# EAGLE design soil_sensor (EAGLE 9.6.2)
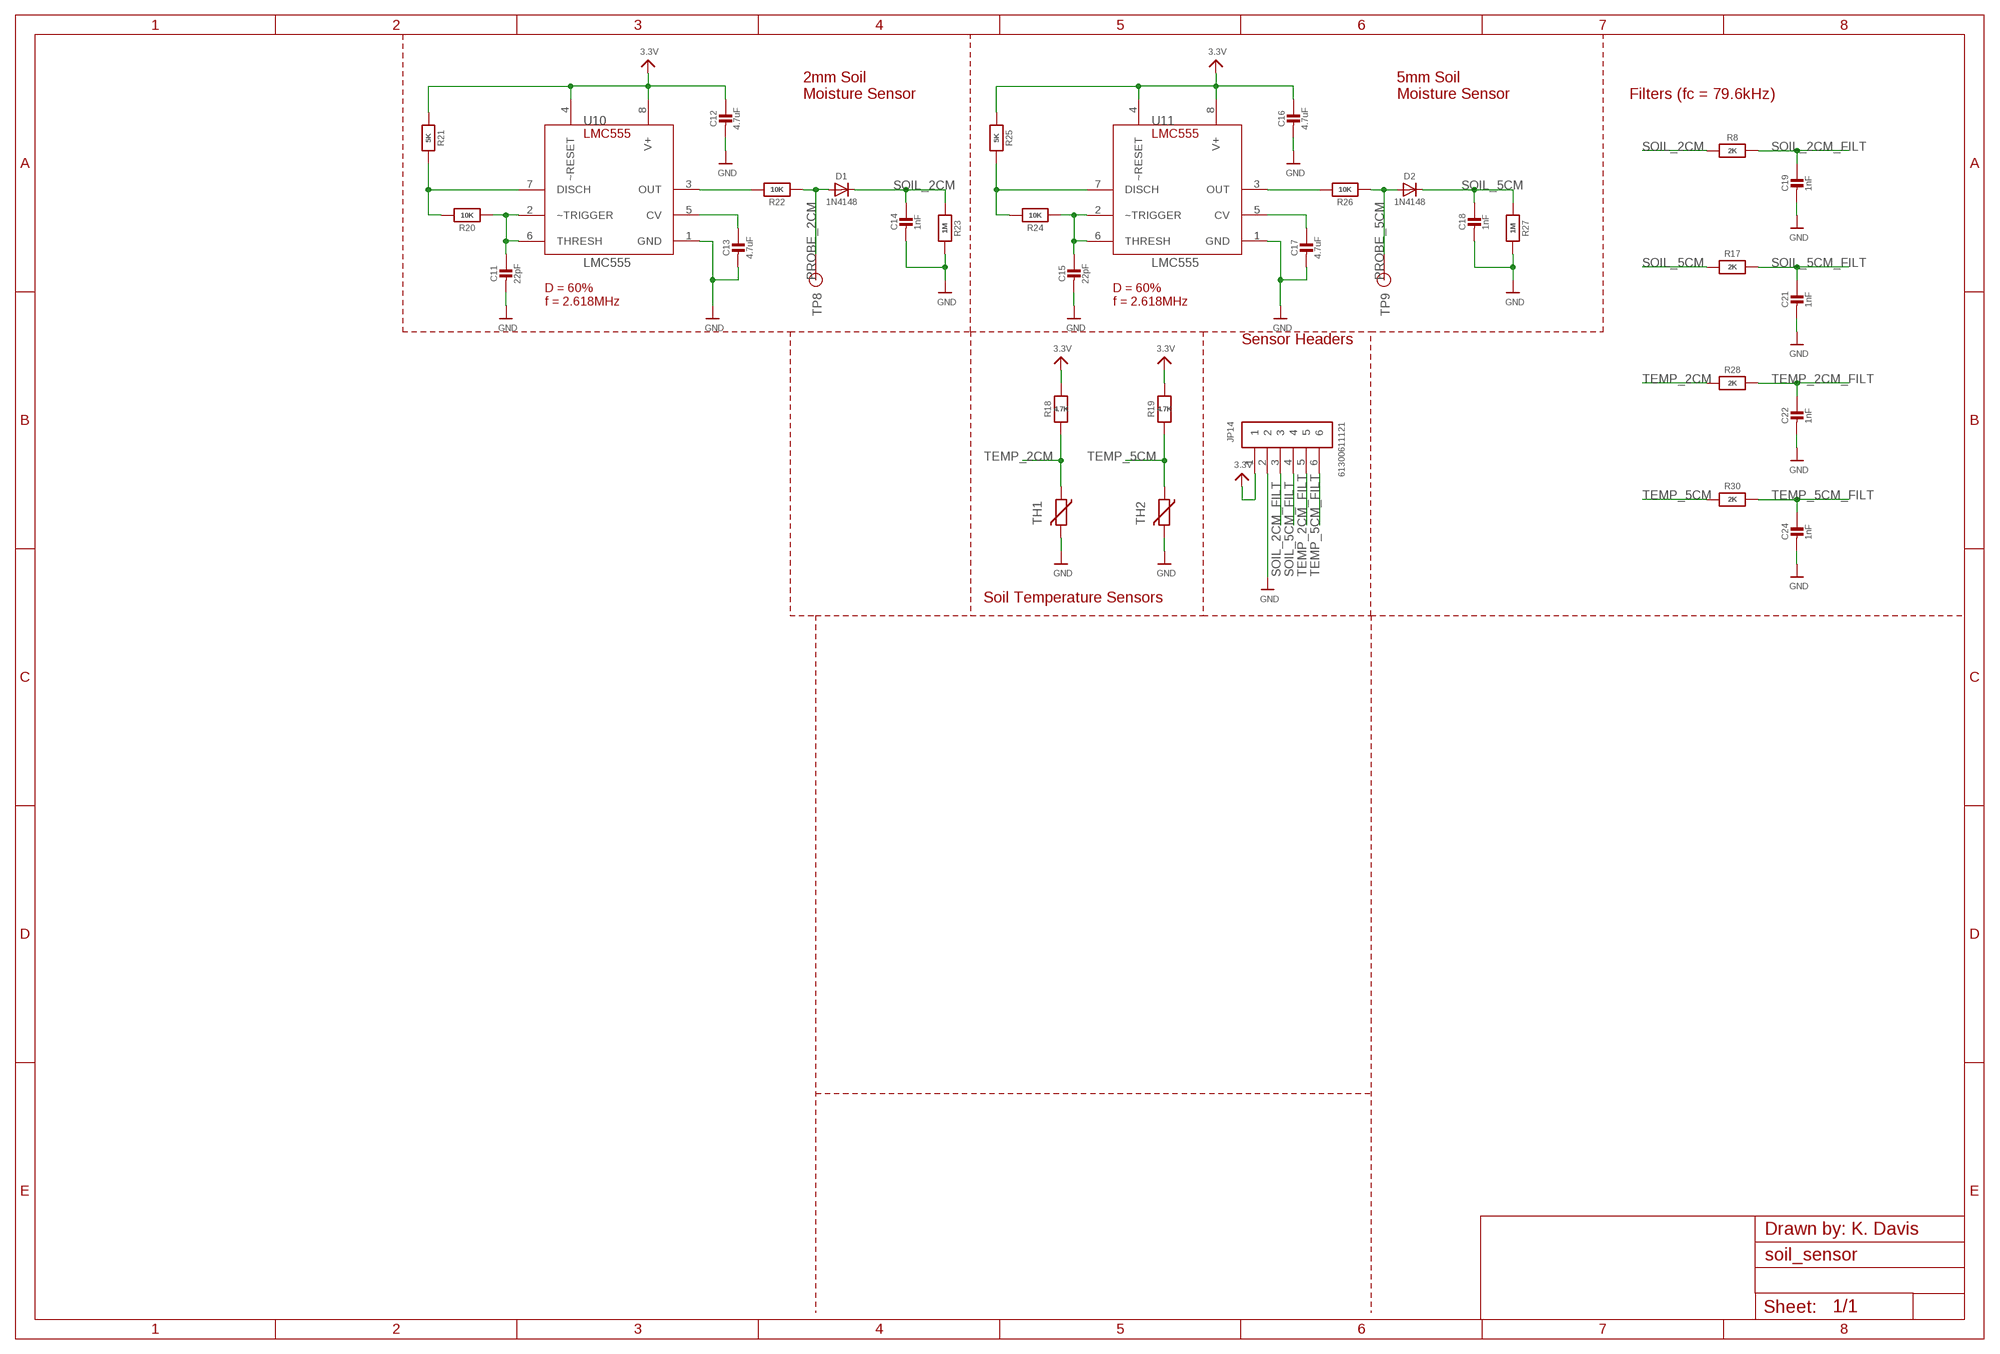
[diagram p0: schematic, sheet 1]

## Parts
C11  22pF  CAP_CERAMIC0805-NOOUTLINE  [0805-NO]
C12  4.7uF  CAP_CERAMIC0805-NOOUTLINE  [0805-NO]
C13  4.7uF  CAP_CERAMIC0805-NOOUTLINE  [0805-NO]
C14  1nF  CAP_CERAMIC0805-NOOUTLINE  [0805-NO]
C15  22pF  CAP_CERAMIC0805-NOOUTLINE  [0805-NO]
C16  4.7uF  CAP_CERAMIC0805-NOOUTLINE  [0805-NO]
C17  4.7uF  CAP_CERAMIC0805-NOOUTLINE  [0805-NO]
C18  1nF  CAP_CERAMIC0805-NOOUTLINE  [0805-NO]
C19  1nF  CAP_CERAMIC0805-NOOUTLINE  [0805-NO]
C21  1nF  CAP_CERAMIC0805-NOOUTLINE  [0805-NO]
C22  1nF  CAP_CERAMIC0805-NOOUTLINE  [0805-NO]
C24  1nF  CAP_CERAMIC0805-NOOUTLINE  [0805-NO]
D1  1N4148  DIODESOD-323  [SOD-323]
D2  1N4148  DIODESOD-323  [SOD-323]
JP14  61300611121  [61300611121]
R8  2K  RESISTOR_0603_NOOUT  [0603-NO]
R17  2K  RESISTOR_0603_NOOUT  [0603-NO]
R18  4.7K  RESISTOR0805_NOOUTLINE  [0805-NO]
R19  4.7K  RESISTOR0805_NOOUTLINE  [0805-NO]
R20  10K  RESISTOR0805_NOOUTLINE  [0805-NO]
R21  5K  RESISTOR0805_NOOUTLINE  [0805-NO]
R22  10K  RESISTOR0805_NOOUTLINE  [0805-NO]
R23  1M  RESISTOR0805_NOOUTLINE  [0805-NO]
R24  10K  RESISTOR0805_NOOUTLINE  [0805-NO]
R25  5K  RESISTOR0805_NOOUTLINE  [0805-NO]
R26  10K  RESISTOR0805_NOOUTLINE  [0805-NO]
R27  1M  RESISTOR0805_NOOUTLINE  [0805-NO]
R28  2K  RESISTOR_0603_NOOUT  [0603-NO]
R30  2K  RESISTOR_0603_NOOUT  [0603-NO]
TH1  VARISTORCN1206  [CT/CN1206]
TH2  VARISTORCN1206  [CT/CN1206]
TP8  TP  [TP_50MIL_CIRC]
TP9  TP  [TP_50MIL_CIRC]
U10  LMC555  [SOIC-8]
U11  LMC555  [SOIC-8]

## Nets
3.3V: C12.1 C16.1 JP14.1 R18.2 R19.2 R21.1 R25.1 U10.4(~RESET) U10.8(V+) U11.4(~RESET) U11.8(V+)
FGD: C11.2 C12.2 C13.2 C14.2 C15.2 C16.2 C17.2 C18.2 C19.2 C21.2 C22.2 C24.2 JP14.2 R23.2 R27.2 TH1.2 TH2.2 U10.1(GND) U11.1(GND) ; supply symbol labelled GND
N$12: C11.1 R20.1 U10.2(~TRIGGER) U10.6(THRESH)
N$14: R20.2 R21.2 U10.7(DISCH)
N$15: C13.1 U10.5(CV)
N$16: C15.1 R24.1 U11.2(~TRIGGER) U11.6(THRESH)
N$19: R24.2 R25.2 U11.7(DISCH)
N$20: R22.2 U10.3(OUT)
N$21: C17.1 U11.5(CV)
N$22: R26.2 U11.3(OUT)
PROBE_2CM: D1.A R22.1 TP8.1(TP)
PROBE_5CM: D2.A R26.1 TP9.1(TP)
SOIL_2CM: C14.1 D1.C R8.1 R23.1
SOIL_2CM_FILT: C19.1 JP14.3 R8.2
SOIL_5CM: C18.1 D2.C R17.1 R27.1
SOIL_5CM_FILT: C21.1 JP14.4 R17.2
TEMP_2CM: R18.1 R28.1 TH1.1
TEMP_2CM_FILT: C22.1 JP14.5 R28.2
TEMP_5CM: R19.1 R30.1 TH2.1
TEMP_5CM_FILT: C24.1 JP14.6 R30.2

## Notes on the sheet
- 2mm Soil
  Moisture Sensor
- 5mm Soil
  Moisture Sensor
- Filters (fc = 79.6kHz)
- D = 60%
  f = 2.618MHz
- D = 60%
  f = 2.618MHz
- Sensor Headers
- Soil Temperature Sensors
- Drawn by: K. Davis

## Library data of the parts
C11-C19 C21 C22 C24 = microbuilder:CAP_CERAMIC: Ceramic Capacitors For new designs, use the packages preceded by an '_' character since they are more reliable: The following footprints should be used on most boards: _0402 - Standard footprint for regular board layouts _0603 - Standard footprint for regular board layouts _0805 - Standard footprint for regular board layouts _1206 - Standard footprint for regular board layouts For extremely tight-pitch boards where space is at a premium, the following 'micro-pitch' footprints can be used (smaller pads, no silkscreen outline, etc.): _0402MP - Micro-pitch footprint for very dense/compact boards _0603MP - Micro-pitch footprint for very dense/compact boards _0805MP - Micro-pitch footprint for very dense/compact boards _1206MP - Micro-pitch footprint for very dense/compact boards
D1 D2 = microbuilder:DIODE: Diode SMA Model Volts Amps Type Vf Ir Digikey # Notes SSA34-E3 40V 3A Schottky 480mV @ 3A 200uA @ 40V SSA34-E3/61TGITR-ND CDBA120-G 20V 1A Schottky 500mV @ 1A 500uA @ 20V 641-1014-6-ND REEL MBRA210 10V 2A Schottky 350mV @ 2A 700uA @ 10V MBRA210LT3 SOD-123 Model Volts Amps Type Vf Ir Order # Notes BAT54T1G 30V 200mA Schottky 800mV @ 200mA 2uA @ 25V BAT54T1GOSTR-ND B0530W 30V 500mA Schottky 430mV @ 500mA 130uA @ 30V B0530W-FDICT-ND REEL MBR120 20V 1A Schottky 340mV @ 1A MBR120VLSFT1GOSCT-ND SOD-323 Model Volts Amps Type Vf Ir Order # Notes PMEG2005EJ 20V 500mA Schottky 355mV @ 500mA 568-4110-1-ND ZLLS410 10V 570mA Schottky 380mV @ 570mA ZLLS410CT-ND 1N4148WS 75V 150mA Silicon/Simple 1V 1N4148WSFSCT-ND REEL SOD-523 Model Volts Amps Type Vf Ir Order # Notes BAT54XV2 30V 200mA Schottky 0.8V @ 100mA BAT54XV2CT-ND TB751S 30V 30mA Schottky RB751S-40TE61CT-ND SOT23-R/W (R = Solder Paste/Reflow Ovens, W = Hand-Soldering) Model Volts Amps Type Vf Ir Order # Notes BAT54FILM 40V 300mA Schottky 497-7162-1-ND POWERDI-5 Model Volts Amps Type Vf Ir Order # Notes PDS560 60V 5A Schottky 670mV @ 5A 150uA @ 60V PDS560DICT-ND
JP14 = EarthPodLib:61300611121: CONN HEADER VERT 5POS 2.54MM Manufacturer's datasheet <https://katalog.we-online.de/em/datasheet/6130xx11121.pdf>; CREATED_BY: PCBLayout.com; DIGI_KEY_PART_NUMBER: 732-5318-ND; MANUFACTURER: Wurth Electronics Inc.; MPN: 61300511121
R8 R17-R28 R30 = microbuilder:RESISTOR: Resistors For new designs, use the packages preceded by an '_' character since they are more reliable: The following footprints should be used on most boards: _0402 - Standard footprint for regular board layouts _0603 - Standard footprint for regular board layouts _0805 - Standard footprint for regular board layouts _1206 - Standard footprint for regular board layouts For extremely tight-pitch boards where space is at a premium, the following 'micro-pitch' footprints can be used (smaller pads, no silkscreen outline, etc.): _0402MP - Micro-pitch footprint for very dense/compact boards _0603MP - Micro-pitch footprint for very dense/compact boards _0805MP - Micro-pitch footprint for very dense/compact boards _1206MP - Micro-pitch footprint for very dense/compact boards
TH1 TH2 = varistor:VARISTOR: VARISTOR
TP8 TP9 = EarthPodLib:TP
U10 U11 = EarthPodLib:LMC555

## Net classes
1 highpower: width 0.305 mm, drill 0.483 mm
2 lowpower: width 0.254 mm, drill 0.483 mm

## Board
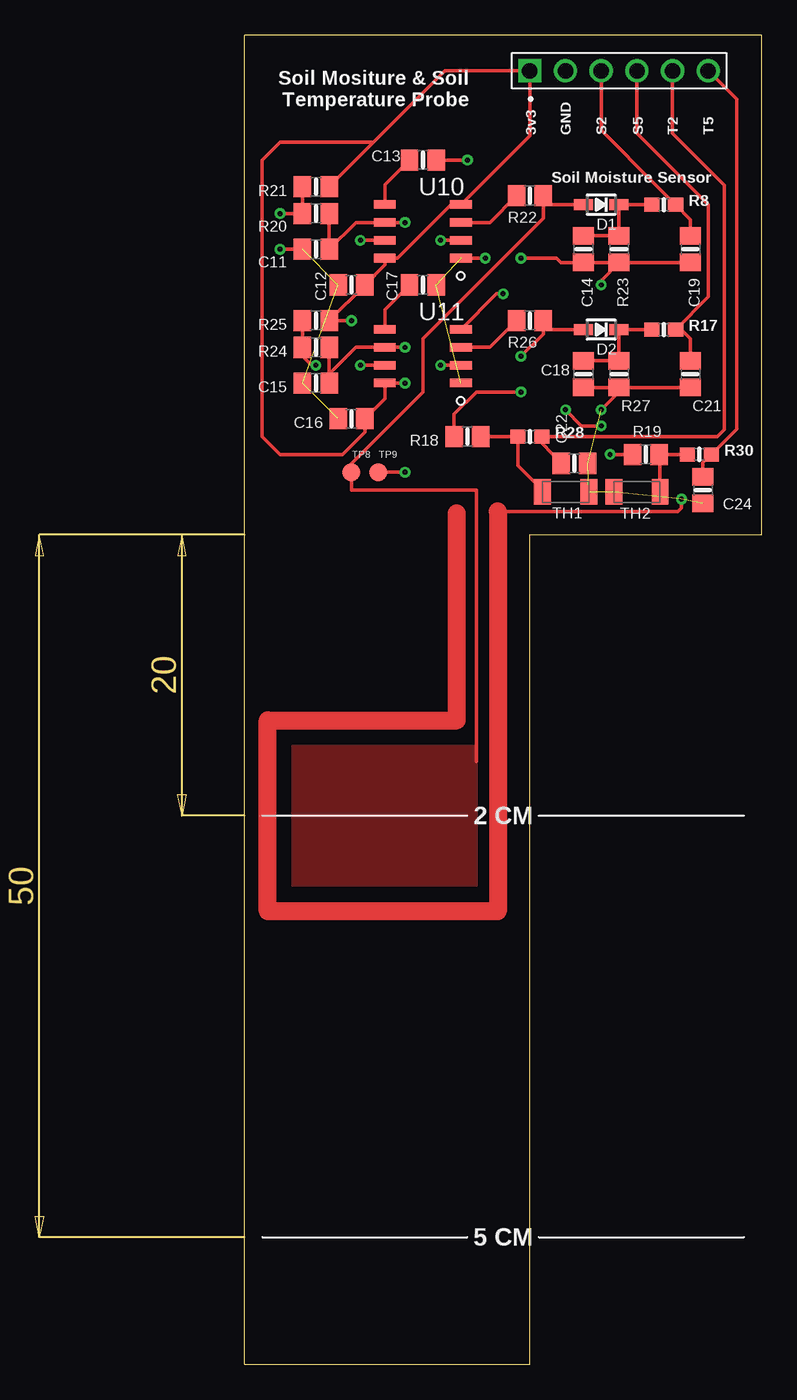
[diagram p1: board, top side]
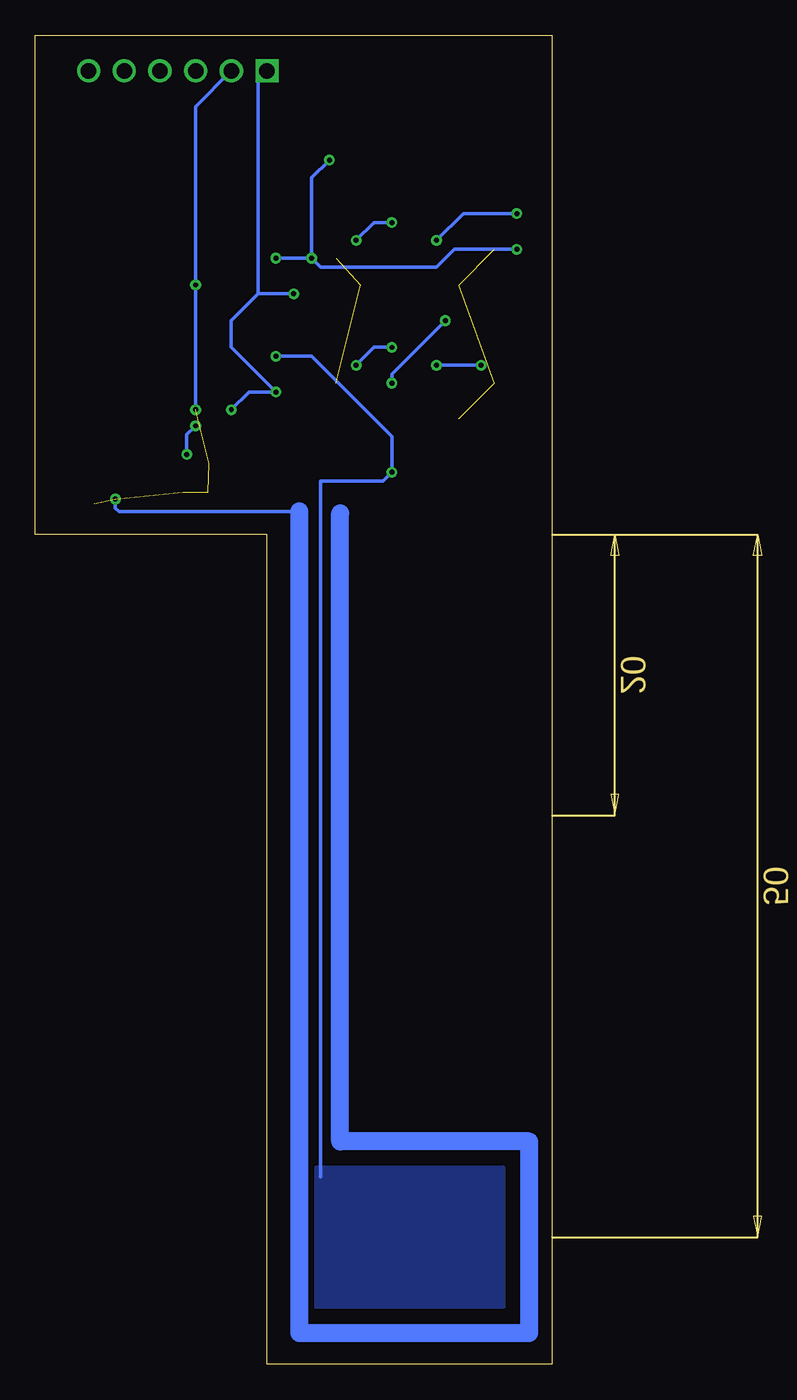
[diagram p2: board, bottom side, seen from below]

Size 36.83 x 94.62 mm. Coordinates in mm from the lower left corner, seen from the top.
Outline: 36.83,59.05 36.83,94.62 0,94.62 0,59.05 0,0 20.32,0 20.32,59.05 36.83,59.05
Copper layers (1*16): Top 0.035mm / dielectric 1.5mm / Bottom 0.035mm
Design rules "default": minimum track width 6mil, minimum drill 0.35mm, track to track 6mil, track to pad 6mil, pad to pad 6mil, via to via 6mil, smd to smd 6mil, copper to edge 40mil, drill to drill 6mil, minimum pad ring 10mil, minimum via ring 8mil, stop-mask expansion 4mil, vias tented up to drill 0mil, thermal gap 10mil

### Footprints (pad centres in the part's own frame; a part is rotated, then mirrored left to right if it is on the bottom)
0805-NO = smd 1.24 x 1.5: 1 -0.95,0; 2 0.95,0
SOD-323 = smd 1.35 x 0.8: A 1.27,0; C -1.27,0
61300611121 = drill 1.1 square: 1 -6.35,0 | drill 1.1: 2 -3.81,0; 3 -1.27,0; 4 1.27,0; 5 3.81,0; 6 6.35,0
0603-NO = smd 1.075 x 1: 1 -0.85,0; 2 0.85,0
CT/CN1206 = smd 1.2 x 1.8: 1 -1.65,0; 2 1.65,0
TP_50MIL_CIRC = smd 1.27 x 1.27: 1 0,0
SOIC-8 = smd 1.549 x 0.61: 1 -2.705,1.905; 2 -2.705,0.635; 3 -2.705,-0.635; 4 -2.705,-1.905; 5 2.705,-1.905; 6 2.705,-0.635; 7 2.705,0.635; 8 2.705,1.905

### Placement (x,y rotation side)
C11  5.08,79.38 180 top
C12  7.62,76.84 180 top
C13  12.7,85.73 0 top
C14  24.13,79.38 270 top
C15  5.08,69.85 180 top
C16  7.62,67.31 180 top
C17  12.7,76.84 0 top
C18  24.13,70.48 270 top
C19  31.75,79.38 270 top
C21  31.75,70.48 270 top
C22  23.5,64.14 0 top
C24  32.64,62.23 270 top
D1  25.4,82.55 180 top
D2  25.4,73.66 180 top
JP14  26.67,92.08 0 top
R8  29.84,82.55 0 top
R17  29.84,73.66 0 top
R18  15.88,66.04 180 top
R19  28.57,64.77 180 top
R20  5.08,81.92 180 top
R21  5.08,83.82 180 top
R22  20.32,83.19 180 top
R23  26.67,79.38 270 top
R24  5.08,72.39 180 top
R25  5.08,74.3 180 top
R26  20.32,74.3 180 top
R27  26.67,70.48 270 top
R28  20.32,66.04 0 top
R30  32.38,64.77 0 top
TH1  22.86,62.1 0 top
TH2  27.94,62.1 180 top
TP8  7.62,63.5 0 top
TP9  9.53,63.5 0 top
U10  12.7,80.65 180 top
U11  12.7,71.76 180 top

### Tracks (layer width: path | path; a pad name or v marks a point on that pad's centre or on a via)
3.3V  (via drill 0.35)
  Top 0.254: R18.2 14.93,67.63 16.51,69.22 v19.68,69.22 | v25.4,66.8 24,66.8 v22.86,67.95 | R19.2 v26.04,64.77 | v7.62,74.3 R25.1 C12.1 9.99,78.26 U10.8 10.88,78.74 14.69,82.55 U10.4 20.32,87.47 JP14.1 14.29,92.08 9.21,87 | v11.43,69.85 U11.8 9.99,68.73 C16.1 8.57,66.36 6.99,64.77 2.54,64.77 1.27,66.04 1.27,85.73 2.54,87 9.21,87 | R21.1 9.21,87 | U11.4 17.95,76.2 v18.41,76.2
  Bottom 0.254: JP14.1 20.95,91.44 20.95,76.2 | v26.04,64.77 26.04,66.17 v25.4,66.8 | v22.86,67.95 21.59,69.22 v19.68,69.22 22.86,72.39 22.86,74.3 20.95,76.2 | v7.62,74.3 11.43,70.48 v11.43,69.85 | v18.41,76.2 20.95,76.2
FGD  (via drill 0.35)  (10 unrouted)
  Top 0.254: C18.2 R27.2 | R27.2 C21.2 | R23.2 C14.2 22.54,78.43 22.23,78.74 v19.68,78.74 | R23.2 C19.2 | v25.4,76.84 25.4,77.16 R23.2 | R27.2 26.67,69.22 v25.4,67.95 | U10.1 v17.14,78.74 | C13.2 v15.88,85.73 | v2.54,79.38 C11.2 | v31.11,61.59 31.11,60.96 30.86,60.71 18.03,60.71
  Top 1.27: 15.11,60.58 15.11,45.85 1.65,45.85 1.65,32.26 18.03,32.26 18.03,60.71
  Bottom 0.254: v25.4,67.95 v25.4,76.84 25.4,89.54 JP14.2 | v15.88,85.73 17.14,84.45 v17.14,78.74 | v2.54,79.38 6.99,79.38 8.26,78.11 16.51,78.11 v17.14,78.74 | v17.14,78.74 v19.68,78.74 | v31.11,61.59 31.11,60.96 30.86,60.71 18.03,60.71
  Bottom 1.27: 18.03,60.71 18.03,2.24 1.65,2.24 1.65,15.88 15.11,15.88 15.11,60.58
N$12  (via drill 0.35)
  Top 0.254: v11.43,81.28 U10.6 7.93,81.28 C11.1 R20.1 | v13.97,80.01 U10.2
  Bottom 0.254: v11.43,81.28 12.7,81.28 v13.97,80.01
N$14  (via drill 0.35)
  Top 0.254: R21.2 R20.2 v2.54,81.92 | U10.7 v8.26,80.01
  Bottom 0.254: v2.54,81.92 6.35,81.92 v8.26,80.01
N$15
  Top 0.254: C13.1 9.99,83.97 U10.5
N$16  (via drill 0.35)
  Top 0.254: v11.43,72.39 U11.6 7.93,72.39 6.03,70.48 C15.1 R24.1 | v13.97,71.12 U11.2
  Bottom 0.254: v11.43,72.39 12.7,72.39 v13.97,71.12
N$19  (via drill 0.35)
  Top 0.254: R25.2 R24.2 4.13,71.76 4.76,71.12 v5.08,71.12 | v8.26,71.12 U11.7
  Bottom 0.254: v8.26,71.12 v5.08,71.12
N$20
  Top 0.254: R22.2 17.46,81.28 U10.3
N$21
  Top 0.254: U11.5 9.99,75.08 C17.1
N$22
  Top 0.254: R26.2 17.46,72.39 U11.3
PROBE_2CM
  Top 0.254: D1.A 21.91,82.55 R22.1 21.27,81.59 12.7,73.03 12.7,69.22 7.62,64.14 TP8.1 7.62,62.23 16.51,62.23 16.51,42.93
  pour Top: 3.43,44.06 16.51,44.06 16.51,34.05 3.43,34.05
PROBE_5CM  (via drill 0.35)
  Top 0.254: TP9.1 v11.43,63.5 | v19.68,71.76 21.27,73.34 R26.1 21.91,73.66 D2.A
  Bottom 0.254: 16.51,13.33 16.51,62.86 12.06,62.86 v11.43,63.5 11.43,66.04 17.14,71.76 v19.68,71.76
  pour Bottom: 3.43,14.06 16.89,14.06 16.89,4.06 3.43,4.06
SOIL_2CM
  Top 0.254: C14.1 R23.1 D1.C R8.1
SOIL_2CM_FILT
  Top 0.152: 31.75,81.5 30.91,82.34 R8.2 29.33,83.91 | 31.75,80.65 C19.1
  Top 0.254: JP14.3 25.4,87.84 29.33,83.91 30.91,82.34 | R8.2 31.75,81.5 31.75,80.65
SOIL_5CM
  Top 0.254: R17.1 D2.C R27.1 C18.1
SOIL_5CM_FILT
  Top 0.254: C21.1 31.75,73.03 31.11,73.66 R17.2 33.02,75.98 33.02,82.55 27.94,87.63 JP14.4
TEMP_2CM
  Top 0.254: R18.1 R28.1 19.47,63.97 21.21,62.23 TH1.1
TEMP_2CM_FILT
  Top 0.254: C22.1 20.95,65.83 R28.2 33.66,66.04 34.16,66.55 34.16,83.95 30.48,87.63 JP14.5
TEMP_5CM
  Top 0.254: TH2.1 29.59,64.7 R19.1 R30.1
TEMP_5CM_FILT
  Top 0.254: C24.1 32.64,64.17 R30.2 35.05,66.59 35.05,90.04 JP14.6

### Text on the board
tNames: Soil Mositure & Soil / Temperature Probe | 3v3 | GND | S2 | S5 | T2 | T5 | Soil Moisture Sensor | 2 CM | 5 CM